# Altium project Core_Board_Pro.PrjPcb
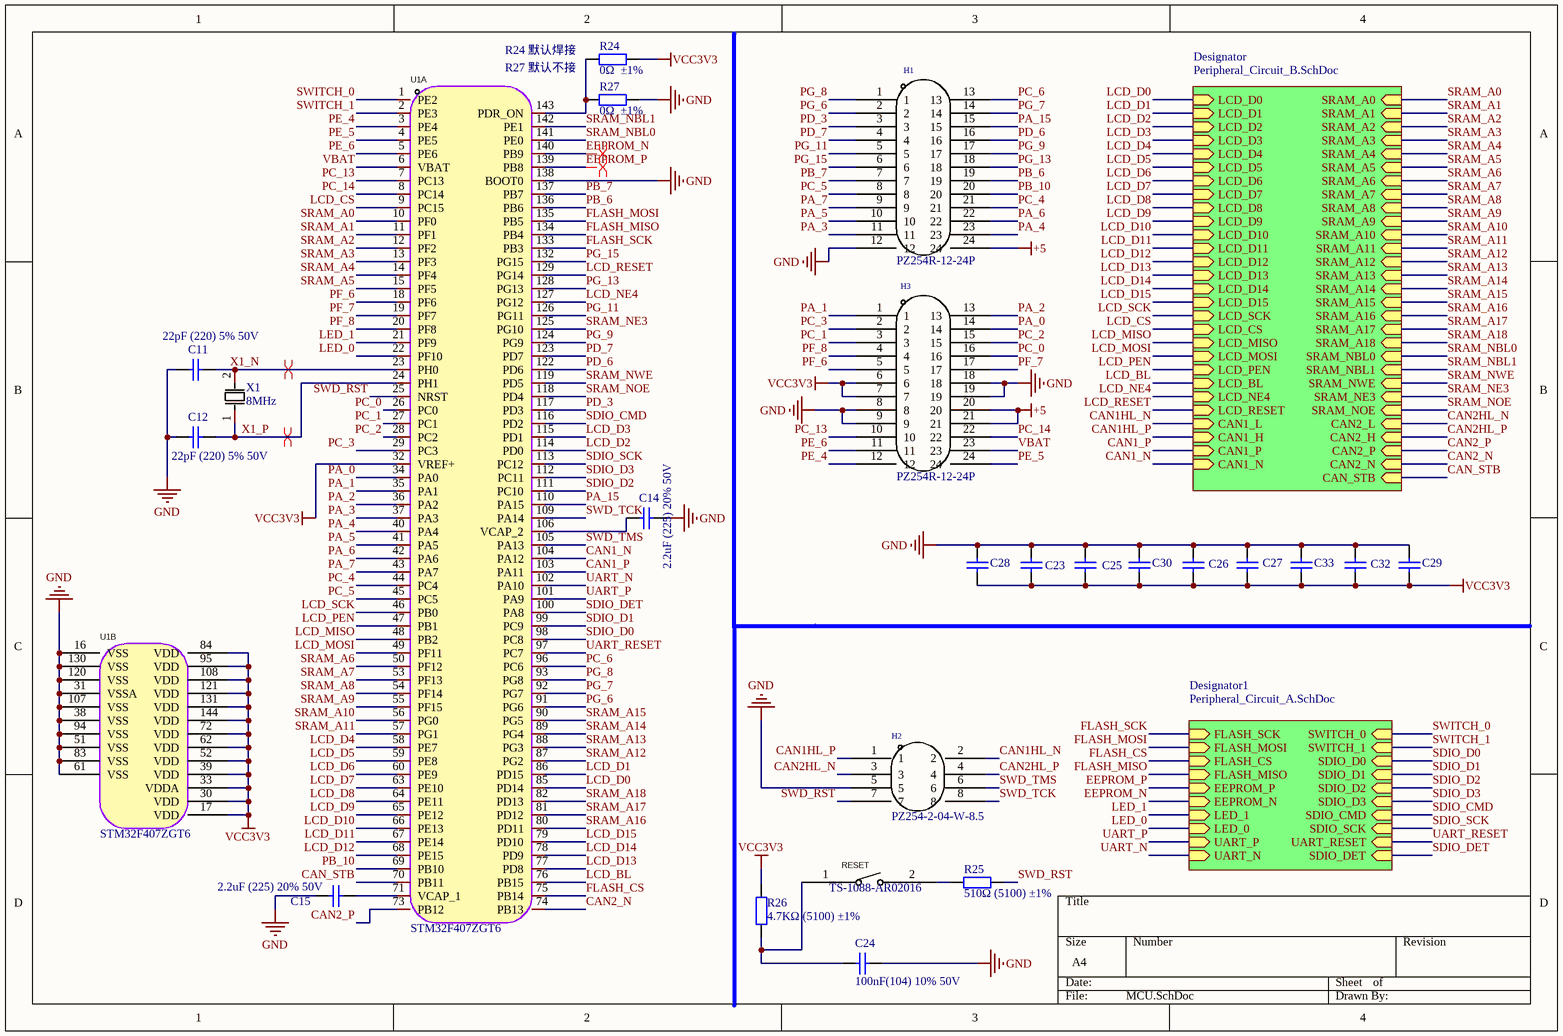
[diagram p0: MCU.SchDoc]
3 sheets, 84 parts. Net scope: hierarchical (ports join the sheet entries above them; power ports are global).
Board file: Monitor_Board.PcbDoc
Sheets:
  MCU.SchDoc
    Designator1 = Peripheral_Circuit_A.SchDoc
    Designator = Peripheral_Circuit_B.SchDoc

## Sheet MCU.SchDoc
size A4

### Parts
C11  22pF (220) 5% 50V  [0805_C]
C12  22pF (220) 5% 50V  [0805_C]
C14  2.2uF (225) 20% 50V  [0805_C]
C15  2.2uF (225) 20% 50V  [0805_C]
C23  100nF(104) 10% 50V  [0805_C]  (value not drawn)
C24  100nF(104) 10% 50V  [0805_C]
C25  100nF(104) 10% 50V  [0805_C]  (value not drawn)
C26  100nF(104) 10% 50V  [0805_C]  (value not drawn)
C27  100nF(104) 10% 50V  [0805_C]  (value not drawn)
C28  100nF(104) 10% 50V  [0805_C]  (value not drawn)
C29  100nF(104) 10% 50V  [0805_C]  (value not drawn)
C30  100nF(104) 10% 50V  [0805_C]  (value not drawn)
C32  100nF(104) 10% 50V  [0805_C]  (value not drawn)
C33  100nF(104) 10% 50V  [0805_C]  (value not drawn)
H1  PZ254R-12-24P  [PZ254R-12-24P]
H2  PZ254-2-04-W-8.5  [PZ254-2-04-W-8.5]
H3  PZ254R-12-24P  [PZ254R-12-24P]
R24  0Ω  ±1%  [0805_R]
R25  510Ω (5100) ±1%  [0805_R]
R26  4.7KΩ (5100) ±1%  [0805_R]
R27  0Ω  ±1%  [0805_R]
RESET  TS-1088-AR02016  [SW-SMD_L3.9-W3.0-P4.45]
U1  STM32F407ZGT6  [LQFP-144_L20.0-W20.0-P0.50-LS22.0-BL]  (parts A,B of 2)
X1  8MHZ  [CRYSTAL-SMD_L5.0-W3.2]

### Sub-sheets
Designator = Peripheral_Circuit_B.SchDoc: LCD_D7 (in), LCD_D13 (in), LCD_D14 (in), LCD_D12 (in), LCD_D0 (in), LCD_SCK (in), LCD_D2 (in), LCD_D4 (in), LCD_D15 (in), LCD_NE4 (in), LCD_D3 (in), LCD_CS (in), LCD_D1 (in), LCD_RESET (in), LCD_MISO (in), LCD_MOSI (in), LCD_D10 (in), LCD_D8 (in), LCD_D6 (in), LCD_D5 (in), LCD_D9 (in), LCD_PEN (in), LCD_D11 (in), LCD_BL (in), SRAM_NWE (in), SRAM_NE3 (in), SRAM_NOE (in), SRAM_A12 (in), SRAM_A13 (in), SRAM_A16 (in), SRAM_A18 (in), SRAM_A10 (in), SRAM_A5 (in), SRAM_A17 (in), SRAM_A9 (in), SRAM_A7 (in), SRAM_A11 (in), SRAM_A15 (in), SRAM_A8 (in), SRAM_A6 (in), SRAM_A2 (in), SRAM_A14 (in), SRAM_NBL0 (in), SRAM_NBL1 (in), SRAM_A3 (in), SRAM_A0 (in), SRAM_A1 (in), SRAM_A4 (in), CAN2_L (in), CAN2_H (in), CAN2_P (in), CAN2_N (in), CAN1_N (in), CAN1_P (in), CAN1_H (in), CAN1_L (in), CAN_STB (in)
Designator1 = Peripheral_Circuit_A.SchDoc: LED_0 (in), SWITCH_1 (in), LED_1 (in), SWITCH_0 (in), SDIO_D0 (in), SDIO_SCK (in), FLASH_CS (in), SDIO_D2 (in), FLASH_SCK (in), SDIO_D3 (in), SDIO_D1 (in), SDIO_CMD (in), FLASH_MOSI (in), FLASH_MISO (in), UART_RESET (in), SDIO_DET (in), EEPROM_P (in), EEPROM_N (in), UART_N (in), UART_P (in)

### Nets
+5: H1.24 H3.20 H3.21
GND: C11.1 C12.1 C14.2 C15.1 C23.2 C24.1 C25.2 C26.2 C27.2 C28.1 C29.1 C30.1 C32.2 C33.1 H1.12 H2.5 H3.8 H3.9 H3.18 H3.19 R27.2 U1.16(VSS) U1.31(VSSA) U1.38(VSS) U1.51(VSS) U1.61(VSS) U1.83(VSS) U1.94(VSS) U1.107(VSS) U1.120(VSS) U1.130(VSS) U1.138(BOOT0)
VCC3V3: C23.1 C25.1 C26.1 C27.1 C28.2 C29.2 C30.2 C32.1 C33.2 H3.6 H3.7 R24.2 R26.1 U1.17(VDD) U1.30(VDD) U1.32(VREF+) U1.33(VDDA) U1.39(VDD) U1.52(VDD) U1.62(VDD) U1.72(VDD) U1.84(VDD) U1.95(VDD) U1.108(VDD) U1.121(VDD) U1.131(VDD) U1.144(VDD)
CAN1_N: U1.104(PA12) ; sheet Designator/CAN1_N
CAN1_P: U1.103(PA11) ; sheet Designator/CAN1_P
CAN1HL_N: H2.2 ; sheet Designator/CAN1_L
CAN1HL_P: H2.1 ; sheet Designator/CAN1_H
CAN2_N: U1.74(PB13) ; sheet Designator/CAN2_N
CAN2_P: U1.73(PB12) ; sheet Designator/CAN2_P
CAN2HL_N: H2.3 ; sheet Designator/CAN2_L
CAN2HL_P: H2.4 ; sheet Designator/CAN2_H
CAN_STB: U1.70(PB11) ; sheet Designator/CAN_STB
EEPROM_N: U1.140(PB9) ; sheet Designator1/EEPROM_N
EEPROM_P: U1.139(PB8) ; sheet Designator1/EEPROM_P
FLASH_CS: U1.75(PB14) ; sheet Designator1/FLASH_CS
FLASH_MISO: U1.134(PB4) ; sheet Designator1/FLASH_MISO
FLASH_MOSI: U1.135(PB5) ; sheet Designator1/FLASH_MOSI
FLASH_SCK: U1.133(PB3) ; sheet Designator1/FLASH_SCK
LCD_BL: U1.76(PB15) ; sheet Designator/LCD_BL
LCD_CS: U1.9(PC15) ; sheet Designator/LCD_CS
LCD_D0: U1.85(PD14) ; sheet Designator/LCD_D0  [project net FPC_LCD_D0]
LCD_D1: U1.86(PD15) ; sheet Designator/LCD_D1  [project net FPC_LCD_D1]
LCD_D2: U1.114(PD0) ; sheet Designator/LCD_D2  [project net FPC_LCD_D2]
LCD_D3: U1.115(PD1) ; sheet Designator/LCD_D3  [project net FPC_LCD_D3]
LCD_D4: U1.58(PE7) ; sheet Designator/LCD_D4  [project net FPC_LCD_D4]
LCD_D5: U1.59(PE8) ; sheet Designator/LCD_D5  [project net FPC_LCD_D5]
LCD_D6: U1.60(PE9) ; sheet Designator/LCD_D6  [project net FPC_LCD_D6]
LCD_D7: U1.63(PE10) ; sheet Designator/LCD_D7  [project net FPC_LCD_D7]
LCD_D8: U1.64(PE11) ; sheet Designator/LCD_D8  [project net FPC_LCD_D8]
LCD_D9: U1.65(PE12) ; sheet Designator/LCD_D9  [project net FPC_LCD_D9]
LCD_D10: U1.66(PE13) ; sheet Designator/LCD_D10  [project net FPC_LCD_D10]
LCD_D11: U1.67(PE14) ; sheet Designator/LCD_D11  [project net FPC_LCD_D11]
LCD_D12: U1.68(PE15) ; sheet Designator/LCD_D12  [project net FPC_LCD_D12]
LCD_D13: U1.77(PD8) ; sheet Designator/LCD_D13  [project net FPC_LCD_D13]
LCD_D14: U1.78(PD9) ; sheet Designator/LCD_D14  [project net FPC_LCD_D14]
LCD_D15: U1.79(PD10) ; sheet Designator/LCD_D15  [project net FPC_LCD_D15]
LCD_MISO: U1.48(PB2) ; sheet Designator/LCD_MISO
LCD_MOSI: U1.49(PF11) ; sheet Designator/LCD_MOSI
LCD_NE4: U1.127(PG12) ; sheet Designator/LCD_NE4
LCD_PEN: U1.47(PB1) ; sheet Designator/LCD_PEN
LCD_RESET: U1.129(PG14) ; sheet Designator/LCD_RESET
LCD_SCK: U1.46(PB0) ; sheet Designator/LCD_SCK
LED_0: U1.22(PF10) ; sheet Designator1/LED_0
LED_1: U1.21(PF9) ; sheet Designator1/LED_1
PA_0: H3.14 U1.34(PA0)
PA_1: H3.1 U1.35(PA1)
PA_2: H3.13 U1.36(PA2)
PA_3: H1.11 U1.37(PA3)
PA_4: H1.23 U1.40(PA4)
PA_5: H1.10 U1.41(PA5)
PA_6: H1.22 U1.42(PA6)
PA_7: H1.9 U1.43(PA7)
PA_15: H1.15 U1.110(PA15)
PB_6: H1.19 U1.136(PB6)
PB_7: H1.7 U1.137(PB7)
PB_10: H1.20 U1.69(PB10)
PC_0: H3.16 U1.26(PC0)
PC_1: H3.3 U1.27(PC1)
PC_2: H3.15 U1.28(PC2)
PC_3: H3.2 U1.29(PC3)
PC_4: H1.21 U1.44(PC4)
PC_5: H1.8 U1.45(PC5)
PC_6: H1.13 U1.96(PC6)
PC_13: H3.10 U1.7(PC13)
PC_14: H3.22 U1.8(PC14)
PD_3: H1.3 U1.117(PD3)
PD_6: H1.16 U1.122(PD6)
PD_7: H1.4 U1.123(PD7)
PE_4: H3.12 U1.3(PE4)
PE_5: H3.24 U1.4(PE5)
PE_6: H3.11 U1.5(PE6)
PF_6: H3.5 U1.18(PF6)
PF_7: H3.17 U1.19(PF7)
PF_8: H3.4 U1.20(PF8)
PG_6: H1.2 U1.91(PG6)
PG_7: H1.14 U1.92(PG7)
PG_8: H1.1 U1.93(PG8)
PG_9: H1.17 U1.124(PG9)
PG_11: H1.5 U1.126(PG11)
PG_13: H1.18 U1.128(PG13)
PG_15: H1.6 U1.132(PG15)
SDIO_CMD: U1.116(PD2) ; sheet Designator1/SDIO_CMD
SDIO_D0: U1.98(PC8) ; sheet Designator1/SDIO_D0
SDIO_D1: U1.99(PC9) ; sheet Designator1/SDIO_D1
SDIO_D2: U1.111(PC10) ; sheet Designator1/SDIO_D2
SDIO_D3: U1.112(PC11) ; sheet Designator1/SDIO_D3
SDIO_DET: U1.100(PA8) ; sheet Designator1/SDIO_DET
SDIO_SCK: U1.113(PC12) ; sheet Designator1/SDIO_SCK
SRAM_A0: U1.10(PF0) ; sheet Designator/SRAM_A0
SRAM_A1: U1.11(PF1) ; sheet Designator/SRAM_A1
SRAM_A2: U1.12(PF2) ; sheet Designator/SRAM_A2
SRAM_A3: U1.13(PF3) ; sheet Designator/SRAM_A3
SRAM_A4: U1.14(PF4) ; sheet Designator/SRAM_A4
SRAM_A5: U1.15(PF5) ; sheet Designator/SRAM_A5
SRAM_A6: U1.50(PF12) ; sheet Designator/SRAM_A6  [project net LCD_A6]
SRAM_A7: U1.53(PF13) ; sheet Designator/SRAM_A7
SRAM_A8: U1.54(PF14) ; sheet Designator/SRAM_A8
SRAM_A9: U1.55(PF15) ; sheet Designator/SRAM_A9
SRAM_A10: U1.56(PG0) ; sheet Designator/SRAM_A10
SRAM_A11: U1.57(PG1) ; sheet Designator/SRAM_A11
SRAM_A12: U1.87(PG2) ; sheet Designator/SRAM_A12
SRAM_A13: U1.88(PG3) ; sheet Designator/SRAM_A13
SRAM_A14: U1.89(PG4) ; sheet Designator/SRAM_A14
SRAM_A15: U1.90(PG5) ; sheet Designator/SRAM_A15
SRAM_A16: U1.80(PD11) ; sheet Designator/SRAM_A16
SRAM_A17: U1.81(PD12) ; sheet Designator/SRAM_A17
SRAM_A18: U1.82(PD13) ; sheet Designator/SRAM_A18
SRAM_NBL0: U1.141(PE0) ; sheet Designator/SRAM_NBL0
SRAM_NBL1: U1.142(PE1) ; sheet Designator/SRAM_NBL1
SRAM_NE3: U1.125(PG10) ; sheet Designator/SRAM_NE3
SRAM_NOE: U1.118(PD4) ; sheet Designator/SRAM_NOE
SRAM_NWE: U1.119(PD5) ; sheet Designator/SRAM_NWE
SWD_RST: H2.7 R25.2 U1.25(NRST)
SWD_TCK: H2.8 U1.109(PA14)
SWD_TMS: H2.6 U1.105(PA13)
SWITCH_0: U1.1(PE2) ; sheet Designator1/SWITCH_0
SWITCH_1: U1.2(PE3) ; sheet Designator1/SWITCH_1
UART_N: U1.102(PA10) ; sheet Designator1/UART_N
UART_P: U1.101(PA9) ; sheet Designator1/UART_P
UART_RESET: U1.97(PC7) ; sheet Designator1/UART_RESET
VBAT: H3.23 U1.6(VBAT)
X1_N: C11.2 U1.23(PH0) X1.2(OSC2)
X1_P: C12.2 U1.24(PH1) X1.1(OSC1)
NetC14_1: C14.1 U1.106(VCAP_2)
NetC15_2: C15.2 U1.71(VCAP_1)
NetC24_2: C24.2 R26.2 RESET.1
NetR24_1: R24.1 R27.1 U1.143(PDR_ON)
NetR25_1: R25.1 RESET.2

### Layout directives
differential pair: EEPROM_N, EEPROM_P, X1_N, X1_P

### Notes on the sheet
- R24 默认焊接
- (near U1) R27 默认不接

### Library data of the parts
C11 C12 = 0805 22pF (220) 5% 50V: 贴片电容; ComponentLink1Description: 供应商链接; ComponentLink1URL: http://www.szlcsc.com/product/details_2156.html; Package: 0805; Supplier: LC; SuppliersPartNumber: C1804
C14 C15 = 0805 2.2uF (225) 20% 50V: 贴片电容; ComponentLink1Description: 供应商链接; ComponentLink1URL: http://www.szlcsc.com/product/details_50225.html; Package: 0805; Supplier: LC; SuppliersPartNumber: C49217
C23-C30 C32 C33 = 0805 100nF(104) 10% 50V: 贴片电容; ComponentLink1Description: 供应商链接; ComponentLink1URL: http://www.szlcsc.com/product/details_50686.html; Package: 0805; Supplier: LC; SuppliersPartNumber: C49678
H1 H3 = PZ254R-12-24P: 2X12P 弯针; Manufacturer: XFCN(兴飞); Add into BOM: yes; Pitch: 2.54mm; Circluar Pins/Square Pins: 方针; Symbol: PZ254R-12-24P; Device: PZ254R-12-24P; Supplier: LCSC; Supplier Part: C492440; Manufacturer Part: PZ254R-12-24P; JLCPCB Part Class: 扩展库; LCSC Part Name: 间距:2.54mm 2x12P 弯插 方针; Supplier Footprint: 弯插,P=2.54mm; Datasheet: https://atta.szlcsc.com/upload/public/pdf/source/20200309/C492440_7713BEBBF73A70D81BA4F83CA4F38610.pdf; Convert to PCB: yes; Pin Structure: 2x12P; Row Spacing: 2.54mm; Mounting Type: 弯插; Number of Rows: 双排; Number of Pins: 24P; Current Rating (Max): -; Voltage Rating (Max): -; Length of Mating Pin: 6mm; Insulation Height: 2.5mm; Contact Material: 黄铜; Contact Plating: -; Operating Temperature Range: -40℃~+105℃; Color: 黑色; Name: PZ254R-12-24P
H2 = PZ254-2-04-W-8.5: 2.54mm 2x4p 弯针; Manufacturer: HCTL(华灿天禄); Add into BOM: yes; Circluar Pins/Square Pins: 方针; Current Rating (Max): 3A; Symbol: PZ254-2-04-W-8.5; Device: PZ254-2-04-W-8.5; Supplier: LCSC; Supplier Part: C2894984; Manufacturer Part: PZ254-2-04-W-8.5; JLCPCB Part Class: 扩展库; LCSC Part Name: 2.54mm 2x4P 弯插 方针; Supplier Footprint: 插件,P=2.54mm; Convert to PCB: yes; Pitch: 2.54mm; Number of Pins: 8; Number of Rows: 2; Pin Structure: 2x4P; Row Spacing: 2.54mm; Mounting Type: 弯插; Voltage Rating (Max): -; Length of Mating Pin: 6mm; Insulation Height: 2.5mm; Length of End Connection Pin: -; Contact Material: -; Operating Temperature Range: -40℃~+105℃; Color: 黑色
R24-R27 = 0805 510Ω (5100) 1%: 贴片电阻; ComponentLink1Description: 供应商链接; ComponentLink1URL: http://www.szlcsc.com/product/details_18422.html; Package: 0805; Supplier: LC; SuppliersPartNumber: C17734
RESET = TS-1088-AR02016: 轻触开关; Manufacturer: XUNPU(讯普); Add into BOM: yes; Circuit: 单刀单掷; Actuator Style: 圆形按钮; Switch Length: 4mm; Switch Width: 3mm; Switch Height: 2mm; Strike Gundam: 不带; Contact Current: 50mA; Voltage Rating (DC): 12V; Insulation Resistance: 100MΩ; Actuator/Cap Color: 黑色; Operating Force: 160gf; Pin Style: SMD接片; Mechanical Life: 10万次; Symbol: TS-1088-AR02016; Device: TS-1088-AR02016; Supplier: LCSC; Supplier Part: C720477; Manufacturer Part: TS-1088-AR02016; JLCPCB Part Class: Extended Part; LCSC Part Name: 4*3*2mm 立贴 轻触开关; Supplier Footprint: SMD; Datasheet: https://atta.szlcsc.com/upload/public/pdf/source/20200810/C720475_60D09DD6C54279ADDB2DC25100F1CC11.pdf; Convert to PCB: yes; Mounting Style: 立贴; Operating Temperature: -30℃~+80℃
U1 = STM32F407ZGT6: STM32F407ZGT6MCU; Manufacturer: ST(意法半导体); Add into BOM: yes; CPU Core: ARM Cortex-M4; Maximum Frequency: 168MHz; Supply Voltage Range: 1.8V~3.6V; Internal Oscillator: 有; Program FLASH Size: 1MB; RAM Size: 192KB; GPIO Ports Number: 114; ADC (Units/Channels/bits): 1@x24ch/12bit; DAC (Units/Channels/bits): 1@x2ch/12bit; Peripherals / Functions / Protocol Stacks: 欠压检测/复位；DMA；LCD驱动；看门狗；POR；PWM; Name: STM32F407ZGT6; Symbol: STM32F407ZGT6; Device: STM32F407ZGT6; LCSC Part Name: ARM Cortex-M4 168MHz 闪存：1MB RAM：192KB; Supplier Part: C19156; Manufacturer Part: STM32F407ZGT6; Supplier Footprint: LQFP-144(20x20); JLCPCB Part Class: Extended Part; Datasheet: https://atta.szlcsc.com/upload/public/pdf/source/20140724/1457707162528.pdf; Supplier: LCSC; Convert to PCB: yes; EEPROM/Data FLASH Size: -; Operating Temperature Range: -40℃~+85℃
X1 = X50328MSB2GI: 贴片晶振; Manufacturer: YXC(扬兴晶振); Add into BOM: yes; Crystal Type: 贴片无源晶振; Load Capacitance: 20pF; Frequency Tolerance: ±10ppm; Frequency Stability: ±50ppm; Symbol: X50328MSB2GI; Device: X50328MSB2GI; Supplier: LCSC; Manufacturer Part: X50328MSB2GI; Value: 8MHz; Supplier Part: C115962; LCSC Part Name: 8MHz ±10ppm 20pF YSX530GA YSX530GA; Supplier Footprint: SMD5032-2P; Datasheet: https://atta.szlcsc.com/upload/public/pdf/source/20230220/0EBFFB9D6D8CE6A211407822BBB6C516.pdf; Convert to PCB: yes; Operating Temperature: -40℃~+85℃; Name: 8MHz

## Sheet Peripheral_Circuit_A.SchDoc
size A4
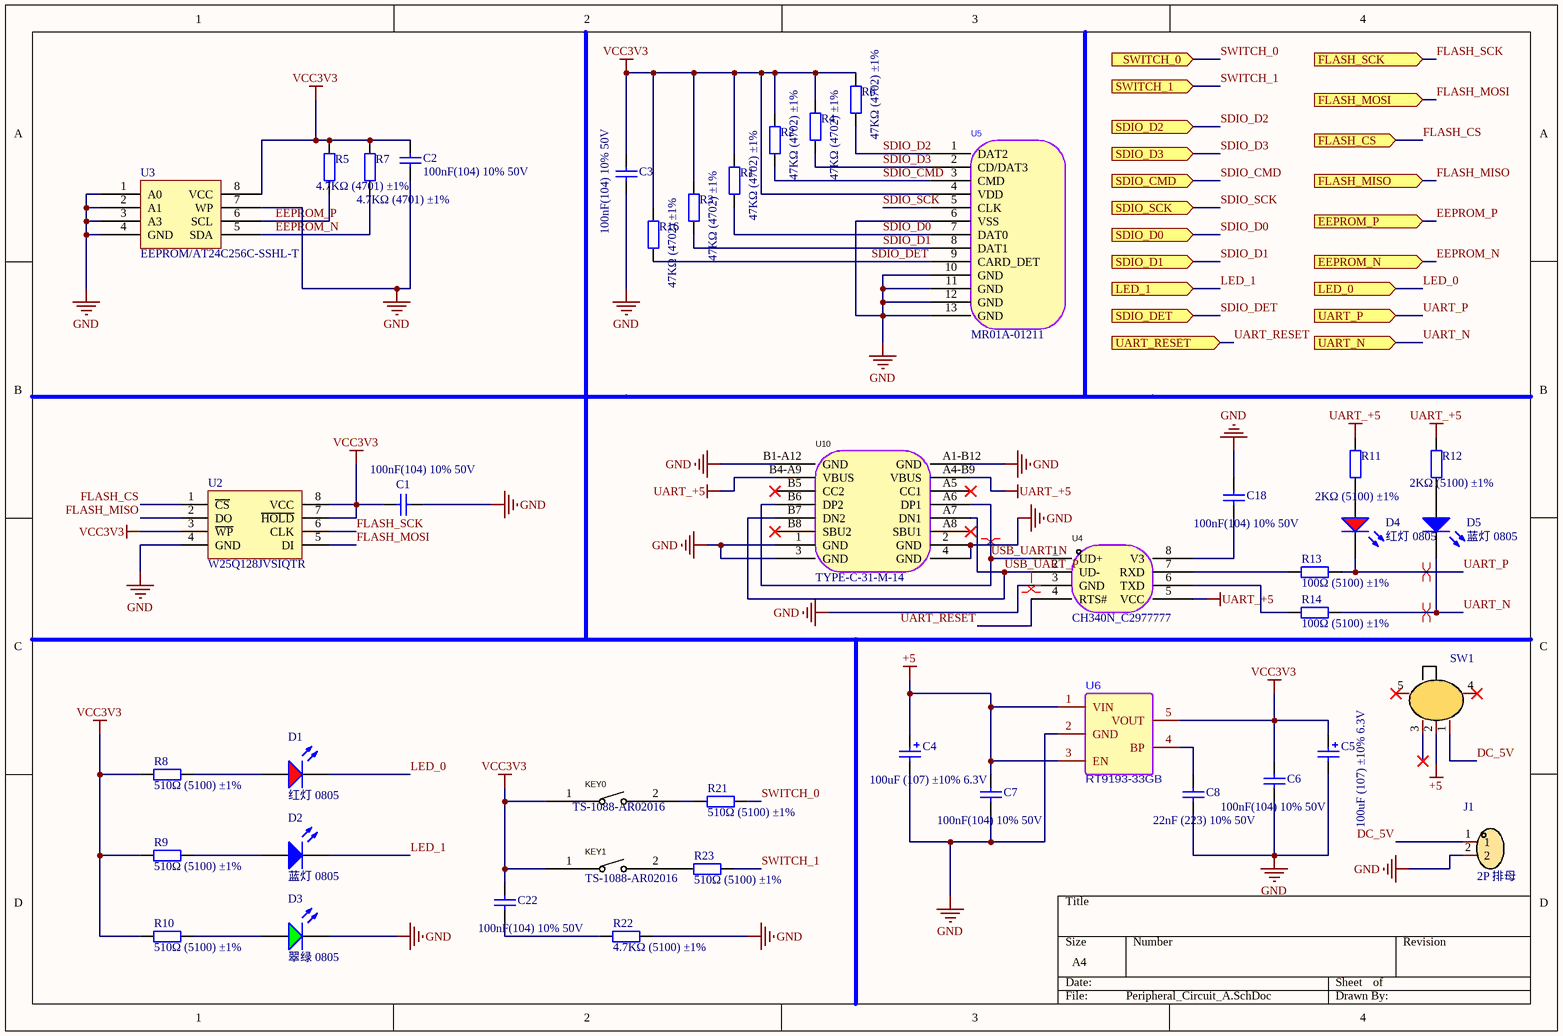
[diagram p1: Peripheral_Circuit_A.SchDoc]

### Parts
C1  100nF(104) 10% 50V  [0805_C]
C2  100nF(104) 10% 50V  [0805_C]
C3  100nF(104) 10% 50V  [0805_C]
C4  100uF (107) ±10% 6.3V  [CASE-B_3528]
C5  100uF (107) ±10% 6.3V  [CASE-B_3528]
C6  100nF(104) 10% 50V  [0805_C]
C7  100nF(104) 10% 50V  [0805_C]
C8  22nF (223) 10% 50V  [0805_C]
C18  100nF(104) 10% 50V  [0805_C]
C22  100nF(104) 10% 50V  [0805_C]
D1  红灯 0805  [0805_LED_S1]
D2  蓝灯 0805  [0805_LED_S1]
D3  翠绿 0805  [0805_LED_S1]
D4  红灯 0805  [0805_LED_S1]
D5  蓝灯 0805  [0805_LED_S1]
J1  2P 排母  [PM254-1-02-W-8.5]
KEY0  TS-1088-AR02016  [SW-SMD_L3.9-W3.0-P4.45]
KEY1  TS-1088-AR02016  [SW-SMD_L3.9-W3.0-P4.45]
R1  47KΩ (4702) ±1%  [0805_R]
R2  47KΩ (4702) ±1%  [0805_R]
R3  47KΩ (4702) ±1%  [0805_R]
R4  47KΩ (4702) ±1%  [0805_R]
R5  4.7KΩ (4701) ±1%  [0805_R]
R6  47KΩ (4702) ±1%  [0805_R]
R7  4.7KΩ (4701) ±1%  [0805_R]
R8  510Ω (5100) ±1%  [0805_R]
R9  510Ω (5100) ±1%  [0805_R]
R10  510Ω (5100) ±1%  [0805_R]
R11  2KΩ (5100) ±1%  [0805_R]
R12  2KΩ (5100) ±1%  [0805_R]
R13  100Ω (5100) ±1%  [0805_R]
R14  100Ω (5100) ±1%  [0805_R]
R16  47KΩ (4702) ±1%  [0805_R]
R21  510Ω (5100) ±1%  [0805_R]
R22  4.7KΩ (5100) ±1%  [0805_R]
R23  510Ω (5100) ±1%  [0805_R]
SW1  SS12D07VG3 087  [SS12D07VG3]  (value not drawn)
U2  W25Q128JVSIQTR  [CH340_N]
U3  EEPROM/AT24C256C-SSHL-T  [CH340_N]
U4  CH340N_C2977777  [CH340_N]
U5  MR01A-01211  [TF-SMD_MR01A-01211]
U6  RT9193-33GB  [RT9193-33GB]
U10  TYPE-C-31-M-14  [TYPE-C-31-M-14]

### Ports
EEPROM_N (in), EEPROM_P (in), FLASH_CS (in), FLASH_MISO (in), FLASH_MOSI (in), FLASH_SCK (in), LED_0 (in), LED_1 (in), SDIO_CMD (in), SDIO_D0 (in), SDIO_D1 (in), SDIO_D2 (in), SDIO_D3 (in), SDIO_DET (in), SDIO_SCK (in), SWITCH_0 (in), SWITCH_1 (in), UART_N (in), UART_P (in), UART_RESET (in)

### Nets
+5: C4.1 C7.2 SW1.2 U6.1(VIN) U6.3(EN)
GND: C1.2 C2.1 C3.1 C4.2 C5.2 C6.1 C7.1 C8.1 C18.1 D3.K J1.2 R22.1 U2.4(GND) U3.1(A0) U3.2(A1) U3.3(A3) U3.4(GND) U3.7(WP) U4.3(GND) U5.6(VSS) U5.10(GND) U5.11(GND) U5.12(GND) U5.13(GND) U6.2(GND) U10.1(GND) U10.2(GND) U10.3(GND) U10.4(GND) U10.A1-B12(GND) U10.B1-A12(GND)
UART_+5: R11.2 R12.2 U4.5(VCC) U10.A4-B9(VBUS) U10.B4-A9(VBUS)
VCC3V3: C1.1 C2.2 C3.2 C5.1 C6.2 C22.2 KEY0.1 KEY1.1 R1.2 R2.2 R3.2 R4.2 R5.2 R6.2 R7.2 R8.1 R9.1 R10.1 R16.2 U2.3(~{WP}) U2.7(~{HOLD}) U2.8(VCC) U3.8(VCC) U5.4(VDD) U6.5(VOUT)
DC_5V: J1.1 SW1.1
EEPROM_N: R7.1 U3.5(SDA) ; port EEPROM_N
EEPROM_P: R5.1 U3.6(SCL) ; port EEPROM_P
FLASH_CS: U2.1(~{CS}) ; port FLASH_CS
FLASH_MISO: U2.2(DO) ; port FLASH_MISO
FLASH_MOSI: U2.5(DI) ; port FLASH_MOSI
FLASH_SCK: U2.6(CLK) ; port FLASH_SCK
LED_0: D1.K ; port LED_0
LED_1: D2.K ; port LED_1
SDIO_CMD: R2.1 U5.3(CMD) ; port SDIO_CMD
SDIO_D0: R1.1 U5.7(DAT0) ; port SDIO_D0
SDIO_D1: R3.1 U5.8(DAT1) ; port SDIO_D1
SDIO_D2: R6.1 U5.1(DAT2) ; port SDIO_D2
SDIO_D3: R4.1 U5.2(CD/DAT3) ; port SDIO_D3
SDIO_DET: R16.1 U5.9(CARD_DET) ; port SDIO_DET
SDIO_SCK: U5.5(CLK) ; port SDIO_SCK
SWITCH_0: R21.2 ; port SWITCH_0
SWITCH_1: R23.2 ; port SWITCH_1
UART_N: D5.K R14.2 ; port UART_N
UART_P: D4.K R13.2 ; port UART_P
UART_RESET: U4.4(RTS#) ; port UART_RESET
USB_UART_N: U4.1(UD+) U10.A6(DP1) U10.B6(DP2)
USB_UART_P: U4.2(UD-) U10.A7(DN1) U10.B7(DN2)
NetC8_2: C8.2 U6.4(BP)
NetC18_2: C18.2 U4.8(V3)
NetC22_1: C22.1 R22.2
NetD1_A: D1.A R8.2
NetD2_A: D2.A R9.2
NetD3_A: D3.A R10.2
NetD4_A: D4.A R11.1
NetD5_A: D5.A R12.1
NetKEY0_2: KEY0.2 R21.1
NetKEY1_2: KEY1.2 R23.1
NetR13_1: R13.1 U4.7(RXD)
NetR14_1: R14.1 U4.6(TXD)

Not connected (* = marked no-connect by the designer): SW1 3* 4* 5*; U10 A5(CC1)* A8(SBU1)* B5(CC2)* B8(SBU2)*

### Layout directives
differential pair: UART_N, UART_P, USB_UART_N, USB_UART_P

### Library data of the parts
C1-C3 C6 C7 C18 C22 = 0805 100nF(104) 10% 50V: 贴片电容; ComponentLink1Description: 供应商链接; ComponentLink1URL: http://www.szlcsc.com/product/details_50686.html; Package: 0805; Supplier: LC; SuppliersPartNumber: C49678
C4 C5 = 3528 100uF (107) 10% 6.3V: 钽电容; ComponentLink1Description: 供应商链接; ComponentLink1URL: http://www.szlcsc.com/product/details_16815.html; Package: 3528; Supplier: LC; SuppliersPartNumber: C16133
C8 = 0805 22nF (223) 10% 50V: 贴片电容; ComponentLink1Description: 供应商链接; ComponentLink1URL: http://www.szlcsc.com/product/details_2081.html; Package: 0805; Supplier: LC; SuppliersPartNumber: C1729
D1 D4 = 0805 红灯: 发光二极管; ComponentLink1Description: 供应商链接; ComponentLink1URL: http://www.szlcsc.com/product/details_2668.html; Package: 0805; Supplier: LC; SuppliersPartNumber: C2295
D2 D5 = 0805 蓝灯: 发光二极管; ComponentLink1Description: 供应商链接; ComponentLink1URL: http://www.szlcsc.com/product/details_2666.html; Package: 0805; Supplier: LC; SuppliersPartNumber: C2293
D3 = 0805 翠绿: 发光二极管; ComponentLink1Description: 供应商链接; ComponentLink1URL: http://www.szlcsc.com/product/details_2670.html; Package: 0805; Supplier: LC; SuppliersPartNumber: C2297
J1 = PM254-1-02-W-8.5: 2p弯针; Manufacturer: HCTL(华灿天禄); Add into BOM: yes; Holes Structure: 1x2P; Pitch: 2.54mm; Circular Hole / Square Hole: 方孔; Current Rating (Max): 3A; Holes Direction: 侧面; Symbol: PM254-1-02-W-8.5; Device: PM254-1-02-W-8.5; Supplier: LCSC; Supplier Part: C2897384; Manufacturer Part: PM254-1-02-W-8.5; JLCPCB Part Class: 扩展库; LCSC Part Name: 间距:2.54mm 1x2P 弯插; Supplier Footprint: 弯插,P=2.54mm; Datasheet: https://atta.szlcsc.com/upload/public/pdf/source/20230609/7BA40A3D721268A082DCDEAD4C99131B.pdf; Convert to PCB: yes; Number of Holes: 2P; Mounting Type: 弯插; Number of Rows: 单排; Row Spacing: -; Voltage Rating (Max): -; Insulation Height: 8.5mm; Operating Temperature Range: -40℃~+105℃
KEY0 KEY1 = TS-1088-AR02016: as RESET on sheet MCU; Symbol: TS-1088-AR02016; Device: TS-1088-AR02016; Supplier: LCSC; Supplier Part: C720477; Manufacturer Part: TS-1088-AR02016; JLCPCB Part Class: Extended Part; LCSC Part Name: 4*3*2mm 立贴 轻触开关; Supplier Footprint: SMD; Datasheet: https://atta.szlcsc.com/upload/public/pdf/source/20200810/C720475_60D09DD6C54279ADDB2DC25100F1CC11.pdf; Convert to PCB: yes; Mounting Style: 立贴; Operating Temperature: -30℃~+80℃
R1-R4 R6 R16 = 0805 47KΩ (4702) 1%: 贴片电阻; ComponentLink1Description: 供应商链接; ComponentLink1URL: http://www.szlcsc.com/product/details_18401.html; Package: 0805; Supplier: LC; SuppliersPartNumber: C17713
R5 R7 = 0805 4.7KΩ (4701) 1%: 贴片电阻; ComponentLink1Description: 供应商链接; ComponentLink1URL: http://www.szlcsc.com/product/details_18361.html; Package: 0805; Supplier: LC; SuppliersPartNumber: C17673
R8-R14 R21-R23 = 0805 510Ω (5100) 1%: 贴片电阻; ComponentLink1Description: 供应商链接; ComponentLink1URL: http://www.szlcsc.com/product/details_18422.html; Package: 0805; Supplier: LC; SuppliersPartNumber: C17734
SW1 = SS12D07VG3 087: 直插贴片开关; Manufacturer: SHOU HAN(首韩); Add into BOM: yes; Circuit: 单刀双掷; Pin Style: PC引脚; Switch Length: 8.7mm; Switch Width: 4.4mm; Switch Height: 4.7mm; Current Rating (DC): 500mA; Voltage Rating (DC): 50V; Mechanical Life: 5千次; Symbol: SS12D07VG3 087; Device: SS12D07VG3 087; Supplier: LCSC; Supplier Part: C2939725; Manufacturer Part: SS12D07VG3 087; JLCPCB Part Class: 扩展库; LCSC Part Name: SS12D07VG3 087; Supplier Footprint: 插件; Datasheet: https://atta.szlcsc.com/upload/public/pdf/source/20220106/77EDD450BA7545A1F1665F035F54D3A4.pdf; Convert to PCB: yes; Actuator Style: -; Mounting Style: 立插; Actuator Color: -; Current Rating (AC): -; Voltage Rating (AC): -; Operating Temperature: -10℃~+50℃
U2 = W25Q128JVSIQTR_[C97521]: Flash ROM; ComponentLink1Description: 供应商链接; ComponentLink1URL: https://item.szlcsc.com/98729.html; Package: SOIC-8; Supplier: LC; SuppliersPartNumber: C97521
U3 = EEPROM/AT24C256C-SSHL-T_[C6482]: EEPROM; ComponentLink1Description: 供应商链接; ComponentLink1URL: http://www.szlcsc.com/product/details_6947.html; Package: SOIC-8_150mil; Supplier: LC; SuppliersPartNumber: C6482
U4 = CH340N_C2977777: TTL串口phy; Designer: U?; Symbol: CH340N_C2977777; Device: CH340N_C2977777
U5 = MR01A-01211: Manufacturer: ATOM(爱特姆); Add into BOM: yes; Card Type: MicroSD卡(TF卡); Connector Type: 卡座; Card Connection Mode: 自弹式; Maximum Body Height: 1.85mm; Name: MR01A-01211; Symbol: MR01A-01211; Device: MR01A-01211; LCSC Part Name: MR01A-01211; Supplier Part: C479742; Manufacturer Part: MR01A-01211; Supplier Footprint: SMD; JLCPCB Part Class: Extended Part; Datasheet: https://atta.szlcsc.com/upload/public/pdf/source/20200107/C479742_0284EDD146B0D8F7A9D47B481AEA01A2.pdf; Supplier: LCSC; Convert to PCB: yes; Operating Temperature Range: -25℃~+85℃
U10 = TYPE-C-31-M-14_1: type-c接口; Manufacturer: 韩国韩荣; Add into BOM: yes; Connector Type: Type-C; Gender: 母座; Number of Contacts: 12; Number of Ports: 1; Name: TYPE-C-31-M-14; Symbol: TYPE-C-31-M-14; Device: TYPE-C-31-M-14; LCSC Part Name: TYPE-C-31-M-14; Supplier Part: C223907; Manufacturer Part: TYPE-C-31-M-14; Supplier Footprint: SMD; JLCPCB Part Class: Extended Part; Datasheet: https://atta.szlcsc.com/upload/public/pdf/source/20210810/33D192CE742AF71F47CC03F903000C62.pdf; Supplier: LCSC; Convert to PCB: yes; Standard: -

## Sheet Peripheral_Circuit_B.SchDoc
size A4
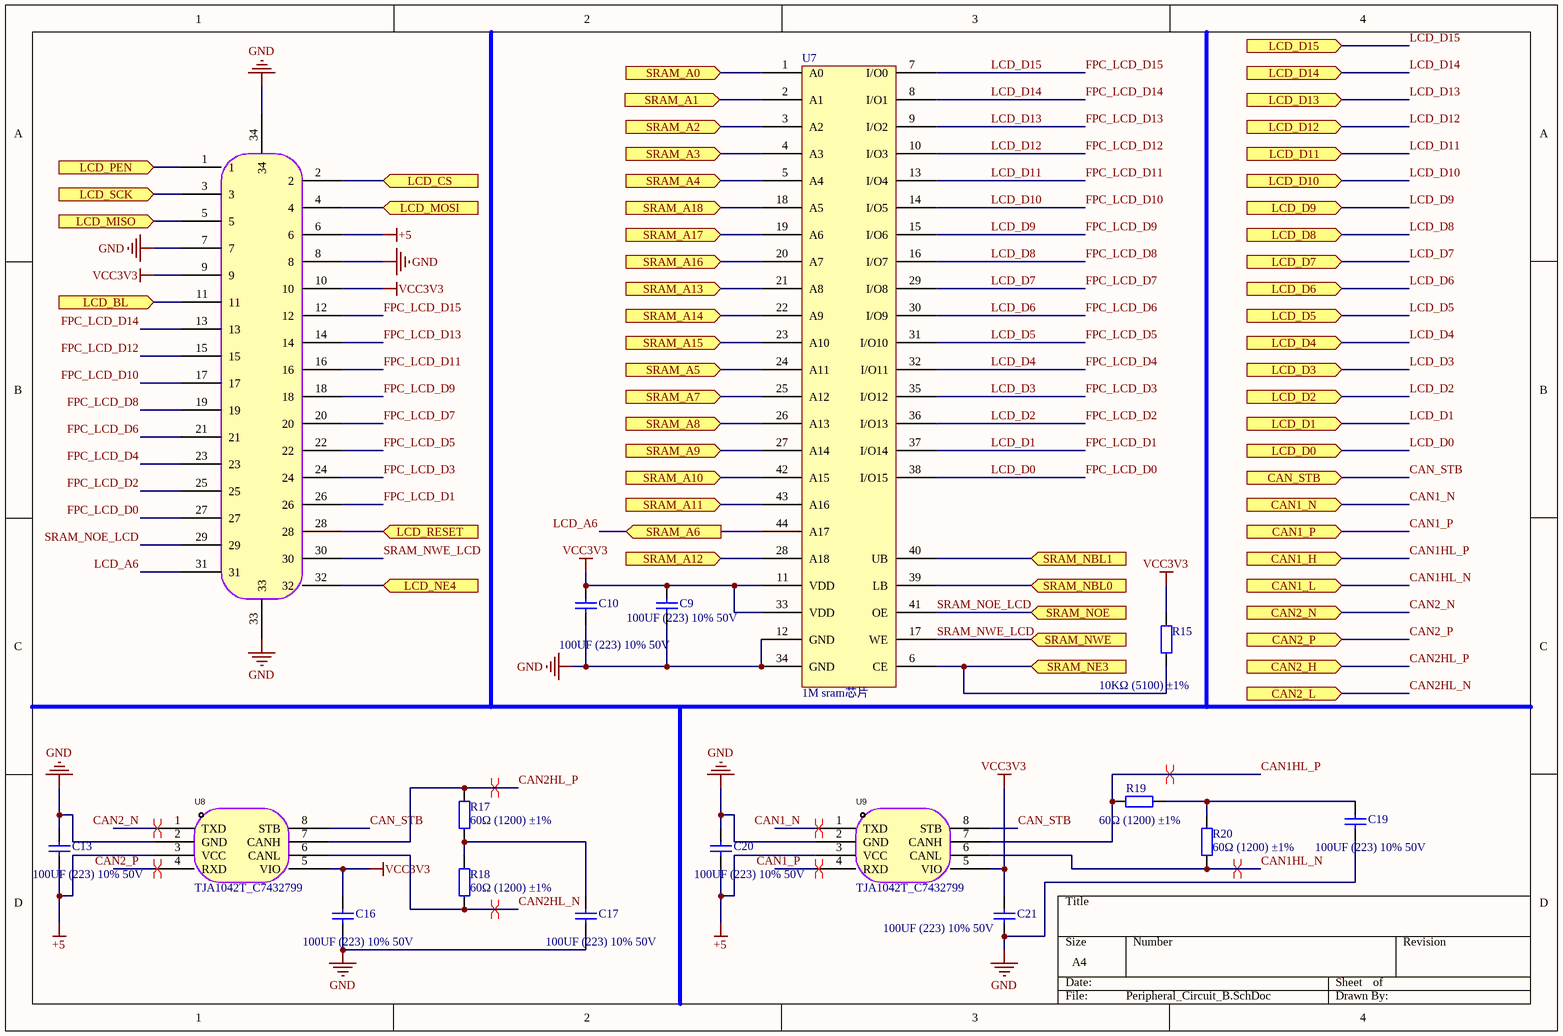
[diagram p2: Peripheral_Circuit_B.SchDoc]

### Parts
C9  100UF (223) 10% 50V  [0805_C]
C10  100UF (223) 10% 50V  [0805_C]
C13  100UF (223) 10% 50V  [0805_C]
C16  100UF (223) 10% 50V  [0805_C]
C17  100UF (223) 10% 50V  [0805_C]
C19  100UF (223) 10% 50V  [0805_C]
C20  100UF (223) 10% 50V  [0805_C]
C21  100UF (223) 10% 50V  [0805_C]
FPC1  FPC-05F-32PH20  [FPC-SMD_32P-P0.50_XUNPU_FPC-05F-32PH20]  (value not drawn)
R15  10KΩ (5100) ±1%  [0805_R]
R17  60Ω (1200) ±1%  [0805_R]
R18  60Ω (1200) ±1%  [0805_R]
R19  60Ω (1200) ±1%  [0805_R]
R20  60Ω (1200) ±1%  [0805_R]
U7  1M sram芯片  [IS61LV51216]
U8  TJA1042T_C7432799  [TJA1042]
U9  TJA1042T_C7432799  [TJA1042]

### Ports
CAN1_H (in), CAN1_L (in), CAN1_N (in), CAN1_P (in), CAN2_H (in), CAN2_L (in), CAN2_N (in), CAN2_P (in), CAN_STB (in), LCD_BL (in), LCD_CS (in), LCD_D0 (in), LCD_D1 (in), LCD_D2 (in), LCD_D3 (in), LCD_D4 (in), LCD_D5 (in), LCD_D6 (in), LCD_D7 (in), LCD_D8 (in), LCD_D9 (in), LCD_D10 (in), LCD_D11 (in), LCD_D12 (in), LCD_D13 (in), LCD_D14 (in), LCD_D15 (in), LCD_MISO (in), LCD_MOSI (in), LCD_NE4 (in), LCD_PEN (in), LCD_RESET (in), LCD_SCK (in), SRAM_A0 (in), SRAM_A1 (in), SRAM_A2 (in), SRAM_A3 (in), SRAM_A4 (in), SRAM_A5 (in), SRAM_A6 (in), SRAM_A7 (in), SRAM_A8 (in), SRAM_A9 (in), SRAM_A10 (in), SRAM_A11 (in), SRAM_A12 (in), SRAM_A13 (in), SRAM_A14 (in), SRAM_A15 (in), SRAM_A16 (in), SRAM_A17 (in), SRAM_A18 (in), SRAM_NBL0 (in), SRAM_NBL1 (in), SRAM_NE3 (in), SRAM_NOE (in), SRAM_NWE (in)

### Nets
+5: C13.1 C20.1 FPC1.6 U8.3(VCC) U9.3(VCC)
GND: C9.1 C10.1 C13.2 C16.1 C17.1 C19.1 C20.2 C21.1 FPC1.7 FPC1.8 FPC1.33 FPC1.34 U7.12(GND) U7.34(GND) U8.2(GND) U9.2(GND)
VCC3V3: C9.2 C10.2 C16.2 C21.2 FPC1.9 FPC1.10 R15.2 U7.11(VDD) U7.33(VDD) U8.5(VIO) U9.5(VIO)
CAN1_N: U9.1(TXD) ; port CAN1_N
CAN1_P: U9.4(RXD) ; port CAN1_P
CAN1HL_N: R20.1 U9.6(CANL) ; port CAN1_L
CAN1HL_P: R19.2 U9.7(CANH) ; port CAN1_H
CAN2_N: U8.1(TXD) ; port CAN2_N
CAN2_P: U8.4(RXD) ; port CAN2_P
CAN2HL_N: R18.1 U8.6(CANL) ; port CAN2_L
CAN2HL_P: R17.2 U8.7(CANH) ; port CAN2_H
CAN_STB: U8.8(STB) U9.8(STB) ; port CAN_STB
FPC_LCD_D0: FPC1.27 U7.38(I/O15) ; port LCD_D0  [also labelled LCD_D0]
FPC_LCD_D1: FPC1.26 U7.37(I/O14) ; port LCD_D1  [also labelled LCD_D1]
FPC_LCD_D2: FPC1.25 U7.36(I/O13) ; port LCD_D2  [also labelled LCD_D2]
FPC_LCD_D3: FPC1.24 U7.35(I/O12) ; port LCD_D3  [also labelled LCD_D3]
FPC_LCD_D4: FPC1.23 U7.32(I/O11) ; port LCD_D4  [also labelled LCD_D4]
FPC_LCD_D5: FPC1.22 U7.31(I/O10) ; port LCD_D5  [also labelled LCD_D5]
FPC_LCD_D6: FPC1.21 U7.30(I/O9) ; port LCD_D6  [also labelled LCD_D6]
FPC_LCD_D7: FPC1.20 U7.29(I/O8) ; port LCD_D7  [also labelled LCD_D7]
FPC_LCD_D8: FPC1.19 U7.16(I/O7) ; port LCD_D8  [also labelled LCD_D8]
FPC_LCD_D9: FPC1.18 U7.15(I/O6) ; port LCD_D9  [also labelled LCD_D9]
FPC_LCD_D10: FPC1.17 U7.14(I/O5) ; port LCD_D10  [also labelled LCD_D10]
FPC_LCD_D11: FPC1.16 U7.13(I/O4) ; port LCD_D11  [also labelled LCD_D11]
FPC_LCD_D12: FPC1.15 U7.10(I/O3) ; port LCD_D12  [also labelled LCD_D12]
FPC_LCD_D13: FPC1.14 U7.9(I/O2) ; port LCD_D13  [also labelled LCD_D13]
FPC_LCD_D14: FPC1.13 U7.8(I/O1) ; port LCD_D14  [also labelled LCD_D14]
FPC_LCD_D15: FPC1.12 U7.7(I/O0) ; port LCD_D15  [also labelled LCD_D15]
LCD_A6: FPC1.31 U7.44(A17) ; port SRAM_A6
LCD_BL: FPC1.11 ; port LCD_BL
LCD_CS: FPC1.2 ; port LCD_CS
LCD_MISO: FPC1.5 ; port LCD_MISO
LCD_MOSI: FPC1.4 ; port LCD_MOSI
LCD_NE4: FPC1.32 ; port LCD_NE4
LCD_PEN: FPC1.1 ; port LCD_PEN
LCD_RESET: FPC1.28 ; port LCD_RESET
LCD_SCK: FPC1.3 ; port LCD_SCK
SRAM_A0: U7.1(A0) ; port SRAM_A0
SRAM_A1: U7.2(A1) ; port SRAM_A1
SRAM_A2: U7.3(A2) ; port SRAM_A2
SRAM_A3: U7.4(A3) ; port SRAM_A3
SRAM_A4: U7.5(A4) ; port SRAM_A4
SRAM_A5: U7.24(A11) ; port SRAM_A5
SRAM_A7: U7.25(A12) ; port SRAM_A7
SRAM_A8: U7.26(A13) ; port SRAM_A8
SRAM_A9: U7.27(A14) ; port SRAM_A9
SRAM_A10: U7.42(A15) ; port SRAM_A10
SRAM_A11: U7.43(A16) ; port SRAM_A11
SRAM_A12: U7.28(A18) ; port SRAM_A12
SRAM_A13: U7.21(A8) ; port SRAM_A13
SRAM_A14: U7.22(A9) ; port SRAM_A14
SRAM_A15: U7.23(A10) ; port SRAM_A15
SRAM_A16: U7.20(A7) ; port SRAM_A16
SRAM_A17: U7.19(A6) ; port SRAM_A17
SRAM_A18: U7.18(A5) ; port SRAM_A18
SRAM_NBL0: U7.39(LB) ; port SRAM_NBL0
SRAM_NBL1: U7.40(UB) ; port SRAM_NBL1
SRAM_NE3: R15.1 U7.6(CE) ; port SRAM_NE3
SRAM_NOE_LCD: FPC1.29 U7.41(OE) ; port SRAM_NOE  [project net SRAM_NOE]
SRAM_NWE_LCD: FPC1.30 U7.17(WE) ; port SRAM_NWE  [project net SRAM_NWE]
NetC17_2: C17.2 R17.1 R18.2
NetC19_2: C19.2 R19.1 R20.2

### Layout directives
differential pair: CAN1_N, CAN1_P, CAN1HL_N, CAN1HL_P, CAN2_N, CAN2_P, CAN2HL_N, CAN2HL_P

### Library data of the parts
C9 C10 C13 C16 C17 C19-C21 = 0805 22nF (223) 10% 50V: 贴片电容; ComponentLink1Description: 供应商链接; ComponentLink1URL: http://www.szlcsc.com/product/details_2081.html; Package: 0805; Supplier: LC; SuppliersPartNumber: C1729
FPC1 = FPC-05F-32PH20: Manufacturer: XUNPU(讯普); Add into BOM: yes; Name: FPC-05F-32PH20; Symbol: FPC-05F-32PH20; Device: FPC-05F-32PH20; LCSC Part Name: 32P 0.5mm; Supplier Part: C2856809; Manufacturer Part: FPC-05F-32PH20; Supplier Footprint: SMD; JLCPCB Part Class: Extended Part; Supplier: LCSC; Convert to PCB: yes
R15 = 0805 510Ω (5100) 1%: 贴片电阻; ComponentLink1Description: 供应商链接; ComponentLink1URL: http://www.szlcsc.com/product/details_18422.html; Package: 0805; Supplier: LC; SuppliersPartNumber: C17734
R17-R20 = 0805 120Ω (1200) 1%: 贴片电阻; ComponentLink1Description: 供应商链接; ComponentLink1URL: http://www.szlcsc.com/product/details_18125.html; Package: 0805; Supplier: LC; SuppliersPartNumber: C17437
U7 = XM8A51216V33A: 外接SRAM芯片
U8 U9 = TJA1042T_C7432799: Manufacturer: Tokmas(托克马斯); Add into BOM: yes; Name: TJA1042T; Symbol: TJA1042T_C7432799; Device: TJA1042T_C7432799; LCSC Part Name: TJA1042T; Supplier Part: C7432799; Manufacturer Part: TJA1042T; Supplier Footprint: SOP-8; JLCPCB Part Class: Extended Part; Datasheet: https://atta.szlcsc.com/upload/public/pdf/source/20230625/BF864921860ECC2FF6AF6AEDC281998F.pdf; Supplier: LCSC; Convert to PCB: yes; link: https://atta.szlcsc.com/upload/public/pdf/source/20230621/7AB02851301655B02FC6140105FC6246.pdf

## Nets that join several sheets
+5: MCU (H1.24 H3.20 H3.21), Peripheral_Circuit_A (5 pins), Peripheral_Circuit_B (5 pins)
GND: MCU (32 pins), Peripheral_Circuit_A (31 pins), Peripheral_Circuit_B (16 pins)
VCC3V3: MCU (27 pins), Peripheral_Circuit_A (25 pins), Peripheral_Circuit_B (11 pins)
CAN1_N: MCU (U1.104), Peripheral_Circuit_B (U9.1)
CAN1_P: MCU (U1.103), Peripheral_Circuit_B (U9.4)
CAN1HL_N: MCU (H2.2), Peripheral_Circuit_B (R20.1 U9.6)
CAN1HL_P: MCU (H2.1), Peripheral_Circuit_B (R19.2 U9.7)
CAN2_N: MCU (U1.74), Peripheral_Circuit_B (U8.1)
CAN2_P: MCU (U1.73), Peripheral_Circuit_B (U8.4)
CAN2HL_N: MCU (H2.3), Peripheral_Circuit_B (R18.1 U8.6)
CAN2HL_P: MCU (H2.4), Peripheral_Circuit_B (R17.2 U8.7)
CAN_STB: MCU (U1.70), Peripheral_Circuit_B (U8.8 U9.8)
EEPROM_N: MCU (U1.140), Peripheral_Circuit_A (R7.1 U3.5)
EEPROM_P: MCU (U1.139), Peripheral_Circuit_A (R5.1 U3.6)
FLASH_CS: MCU (U1.75), Peripheral_Circuit_A (U2.1)
FLASH_MISO: MCU (U1.134), Peripheral_Circuit_A (U2.2)
FLASH_MOSI: MCU (U1.135), Peripheral_Circuit_A (U2.5)
FLASH_SCK: MCU (U1.133), Peripheral_Circuit_A (U2.6)
FPC_LCD_D0: MCU (U1.85), Peripheral_Circuit_B (FPC1.27 U7.38)
FPC_LCD_D1: MCU (U1.86), Peripheral_Circuit_B (FPC1.26 U7.37)
FPC_LCD_D2: MCU (U1.114), Peripheral_Circuit_B (FPC1.25 U7.36)
FPC_LCD_D3: MCU (U1.115), Peripheral_Circuit_B (FPC1.24 U7.35)
FPC_LCD_D4: MCU (U1.58), Peripheral_Circuit_B (FPC1.23 U7.32)
FPC_LCD_D5: MCU (U1.59), Peripheral_Circuit_B (FPC1.22 U7.31)
FPC_LCD_D6: MCU (U1.60), Peripheral_Circuit_B (FPC1.21 U7.30)
FPC_LCD_D7: MCU (U1.63), Peripheral_Circuit_B (FPC1.20 U7.29)
FPC_LCD_D8: MCU (U1.64), Peripheral_Circuit_B (FPC1.19 U7.16)
FPC_LCD_D9: MCU (U1.65), Peripheral_Circuit_B (FPC1.18 U7.15)
FPC_LCD_D10: MCU (U1.66), Peripheral_Circuit_B (FPC1.17 U7.14)
FPC_LCD_D11: MCU (U1.67), Peripheral_Circuit_B (FPC1.16 U7.13)
FPC_LCD_D12: MCU (U1.68), Peripheral_Circuit_B (FPC1.15 U7.10)
FPC_LCD_D13: MCU (U1.77), Peripheral_Circuit_B (FPC1.14 U7.9)
FPC_LCD_D14: MCU (U1.78), Peripheral_Circuit_B (FPC1.13 U7.8)
FPC_LCD_D15: MCU (U1.79), Peripheral_Circuit_B (FPC1.12 U7.7)
LCD_A6: MCU (U1.50), Peripheral_Circuit_B (FPC1.31 U7.44)
LCD_BL: MCU (U1.76), Peripheral_Circuit_B (FPC1.11)
LCD_CS: MCU (U1.9), Peripheral_Circuit_B (FPC1.2)
LCD_MISO: MCU (U1.48), Peripheral_Circuit_B (FPC1.5)
LCD_MOSI: MCU (U1.49), Peripheral_Circuit_B (FPC1.4)
LCD_NE4: MCU (U1.127), Peripheral_Circuit_B (FPC1.32)
LCD_PEN: MCU (U1.47), Peripheral_Circuit_B (FPC1.1)
LCD_RESET: MCU (U1.129), Peripheral_Circuit_B (FPC1.28)
LCD_SCK: MCU (U1.46), Peripheral_Circuit_B (FPC1.3)
LED_0: MCU (U1.22), Peripheral_Circuit_A (D1.K)
LED_1: MCU (U1.21), Peripheral_Circuit_A (D2.K)
SDIO_CMD: MCU (U1.116), Peripheral_Circuit_A (R2.1 U5.3)
SDIO_D0: MCU (U1.98), Peripheral_Circuit_A (R1.1 U5.7)
SDIO_D1: MCU (U1.99), Peripheral_Circuit_A (R3.1 U5.8)
SDIO_D2: MCU (U1.111), Peripheral_Circuit_A (R6.1 U5.1)
SDIO_D3: MCU (U1.112), Peripheral_Circuit_A (R4.1 U5.2)
SDIO_DET: MCU (U1.100), Peripheral_Circuit_A (R16.1 U5.9)
SDIO_SCK: MCU (U1.113), Peripheral_Circuit_A (U5.5)
SRAM_A0: MCU (U1.10), Peripheral_Circuit_B (U7.1)
SRAM_A1: MCU (U1.11), Peripheral_Circuit_B (U7.2)
SRAM_A2: MCU (U1.12), Peripheral_Circuit_B (U7.3)
SRAM_A3: MCU (U1.13), Peripheral_Circuit_B (U7.4)
SRAM_A4: MCU (U1.14), Peripheral_Circuit_B (U7.5)
SRAM_A5: MCU (U1.15), Peripheral_Circuit_B (U7.24)
SRAM_A7: MCU (U1.53), Peripheral_Circuit_B (U7.25)
SRAM_A8: MCU (U1.54), Peripheral_Circuit_B (U7.26)
SRAM_A9: MCU (U1.55), Peripheral_Circuit_B (U7.27)
SRAM_A10: MCU (U1.56), Peripheral_Circuit_B (U7.42)
SRAM_A11: MCU (U1.57), Peripheral_Circuit_B (U7.43)
SRAM_A12: MCU (U1.87), Peripheral_Circuit_B (U7.28)
SRAM_A13: MCU (U1.88), Peripheral_Circuit_B (U7.21)
SRAM_A14: MCU (U1.89), Peripheral_Circuit_B (U7.22)
SRAM_A15: MCU (U1.90), Peripheral_Circuit_B (U7.23)
SRAM_A16: MCU (U1.80), Peripheral_Circuit_B (U7.20)
SRAM_A17: MCU (U1.81), Peripheral_Circuit_B (U7.19)
SRAM_A18: MCU (U1.82), Peripheral_Circuit_B (U7.18)
SRAM_NBL0: MCU (U1.141), Peripheral_Circuit_B (U7.39)
SRAM_NBL1: MCU (U1.142), Peripheral_Circuit_B (U7.40)
SRAM_NE3: MCU (U1.125), Peripheral_Circuit_B (R15.1 U7.6)
SRAM_NOE: MCU (U1.118), Peripheral_Circuit_B (FPC1.29 U7.41)
SRAM_NWE: MCU (U1.119), Peripheral_Circuit_B (FPC1.30 U7.17)
SWITCH_0: MCU (U1.1), Peripheral_Circuit_A (R21.2)
SWITCH_1: MCU (U1.2), Peripheral_Circuit_A (R23.2)
UART_N: MCU (U1.102), Peripheral_Circuit_A (D5.K R14.2)
UART_P: MCU (U1.101), Peripheral_Circuit_A (D4.K R13.2)
UART_RESET: MCU (U1.97), Peripheral_Circuit_A (U4.4)